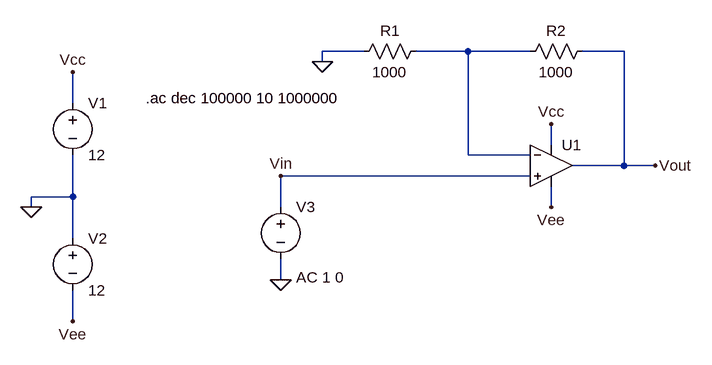
[diagram p0: schematic Apartado_A.asc]
Apartado_A.asc, the LTspice schematic file:
Version 4
SHEET 1 1112 680
WIRE 592 -224 528 -224
WIRE 752 -224 672 -224
WIRE 848 -224 752 -224
WIRE 992 -224 928 -224
WIRE 528 -208 528 -224
WIRE 144 -144 144 -192
WIRE 880 -80 880 -112
WIRE 752 -64 752 -224
WIRE 848 -64 752 -64
WIRE 992 -48 992 -224
WIRE 992 -48 912 -48
WIRE 1040 -48 992 -48
WIRE 848 -32 464 -32
WIRE 144 0 144 -64
WIRE 144 0 80 0
WIRE 80 16 80 0
WIRE 464 16 464 -32
WIRE 880 16 880 -16
WIRE 144 64 144 0
WIRE 464 128 464 96
WIRE 144 192 144 144
FLAG 528 -208 0
FLAG 464 128 0
FLAG 80 16 0
FLAG 144 -192 Vcc
FLAG 880 -112 Vcc
FLAG 880 16 Vee
FLAG 144 192 Vee
FLAG 464 -32 Vin
FLAG 1040 -48 Vout
SYMBOL voltage 144 -160 R0
WINDOW 123 0 0 Left 2
WINDOW 39 0 0 Left 2
SYMATTR InstName V1
SYMATTR Value 12
SYMBOL voltage 144 48 R0
WINDOW 123 0 0 Left 2
WINDOW 39 0 0 Left 2
SYMATTR InstName V2
SYMATTR Value 12
SYMBOL voltage 464 0 R0
WINDOW 3 24 96 Invisible 2
WINDOW 123 24 124 Left 2
WINDOW 39 0 0 Left 2
SYMATTR Value SINE(0)
SYMATTR Value2 AC 1 0
SYMATTR InstName V3
SYMBOL res 688 -240 R90
WINDOW 0 0 56 VBottom 2
WINDOW 3 32 56 VTop 2
SYMATTR InstName R1
SYMATTR Value 1000
SYMBOL res 944 -240 R90
WINDOW 0 0 56 VBottom 2
WINDOW 3 32 56 VTop 2
SYMATTR InstName R2
SYMATTR Value 1000
SYMBOL Opamps\\UniversalOpamp2 880 -48 R0
SYMATTR InstName U1
TEXT 256 -152 Left 2 !.ac dec 100000 10 1000000

The netlist it stands for:
* Apartado_A.asc
V1 Vcc 0 12
V2 0 Vee 12
V3 Vin 0 SINE(0) AC 1 0
R1 N001 0 1000
R2 Vout N001 1000
XU1 Vin N001 Vcc Vee Vout level.2 Avol=1Meg GBW=10Meg Slew=10Meg ilimit=25m rail=0 Vos=0 phimargin=45 en=0 enk=0 in=0 ink=0 Rin=500Meg  ; pins IN+ IN- V+ V- OUT
.ac dec 100000 10 1000000
.lib UniversalOpamps2.sub
.backanno
.end

* Results of the author's LTspice run, read from the files saved beside the schematic
* Operating Point, zero values left out:
*   V(vcc) = 12 V
*   V(vee) = -12 V
*   I(V2) = -1.199 mA
*   I(V1) = -1.199 mA
*   Ix(u1:3) = 1.199 mA
*   Ix(u1:4) = -1.199 mA